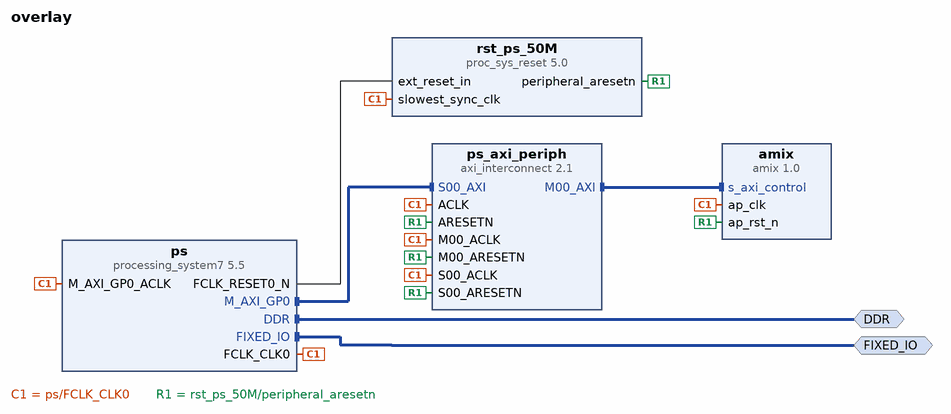
[diagram p0: block diagram of the top level]
# Vivado block design overlay, xc7z020clg400-1, Vivado 2020.2
create_bd_design overlay

create_bd_intf_port -mode Master -vlnv xilinx.com:interface:ddrx_rtl:1.0 DDR
create_bd_intf_port -mode Master -vlnv xilinx.com:display_processing_system7:fixedio_rtl:1.0 FIXED_IO

create_bd_cell -type ip -vlnv xilinx.com:ip:processing_system7:5.5 ps
# 1 more settings of ps are not shown: defaults, MIO pin electricals, DDR timing, and values the tool derives
create_bd_cell -type ip -vlnv xilinx.com:ip:axi_interconnect:2.1 ps_axi_periph
set_property -dict {CONFIG.NUM_MI 1} [get_bd_cells ps_axi_periph]
create_bd_cell -type ip -vlnv xilinx.com:ip:proc_sys_reset:5.0 rst_ps_50M
create_bd_cell -type ip -vlnv xilinx.com:hls:amix:1.0 amix

# ---- connections ----

connect_bd_intf_net [get_bd_intf_ports DDR] [get_bd_intf_pins ps/DDR]
connect_bd_intf_net [get_bd_intf_pins ps_axi_periph/M00_AXI] [get_bd_intf_pins amix/s_axi_control]
connect_bd_intf_net [get_bd_intf_ports FIXED_IO] [get_bd_intf_pins ps/FIXED_IO]
connect_bd_intf_net [get_bd_intf_pins ps/M_AXI_GP0] [get_bd_intf_pins ps_axi_periph/S00_AXI]
connect_bd_net [get_bd_pins ps/FCLK_CLK0] \
  [get_bd_pins ps/M_AXI_GP0_ACLK] [get_bd_pins ps_axi_periph/S00_ACLK] [get_bd_pins rst_ps_50M/slowest_sync_clk] \
  [get_bd_pins ps_axi_periph/M00_ACLK] [get_bd_pins ps_axi_periph/ACLK] [get_bd_pins amix/ap_clk]
connect_bd_net [get_bd_pins ps/FCLK_RESET0_N] [get_bd_pins rst_ps_50M/ext_reset_in]
connect_bd_net [get_bd_pins rst_ps_50M/peripheral_aresetn] \
  [get_bd_pins ps_axi_periph/S00_ARESETN] [get_bd_pins ps_axi_periph/M00_ARESETN] [get_bd_pins ps_axi_periph/ARESETN] \
  [get_bd_pins amix/ap_rst_n]

# ---- address map ----
assign_bd_address -offset 0x40000000 -range 64K -target_address_space [get_bd_addr_spaces ps/Data] [get_bd_addr_segs amix/s_axi_control/Reg]

validate_bd_design
save_bd_design
